# Altium project AnySkin.PrjPcb
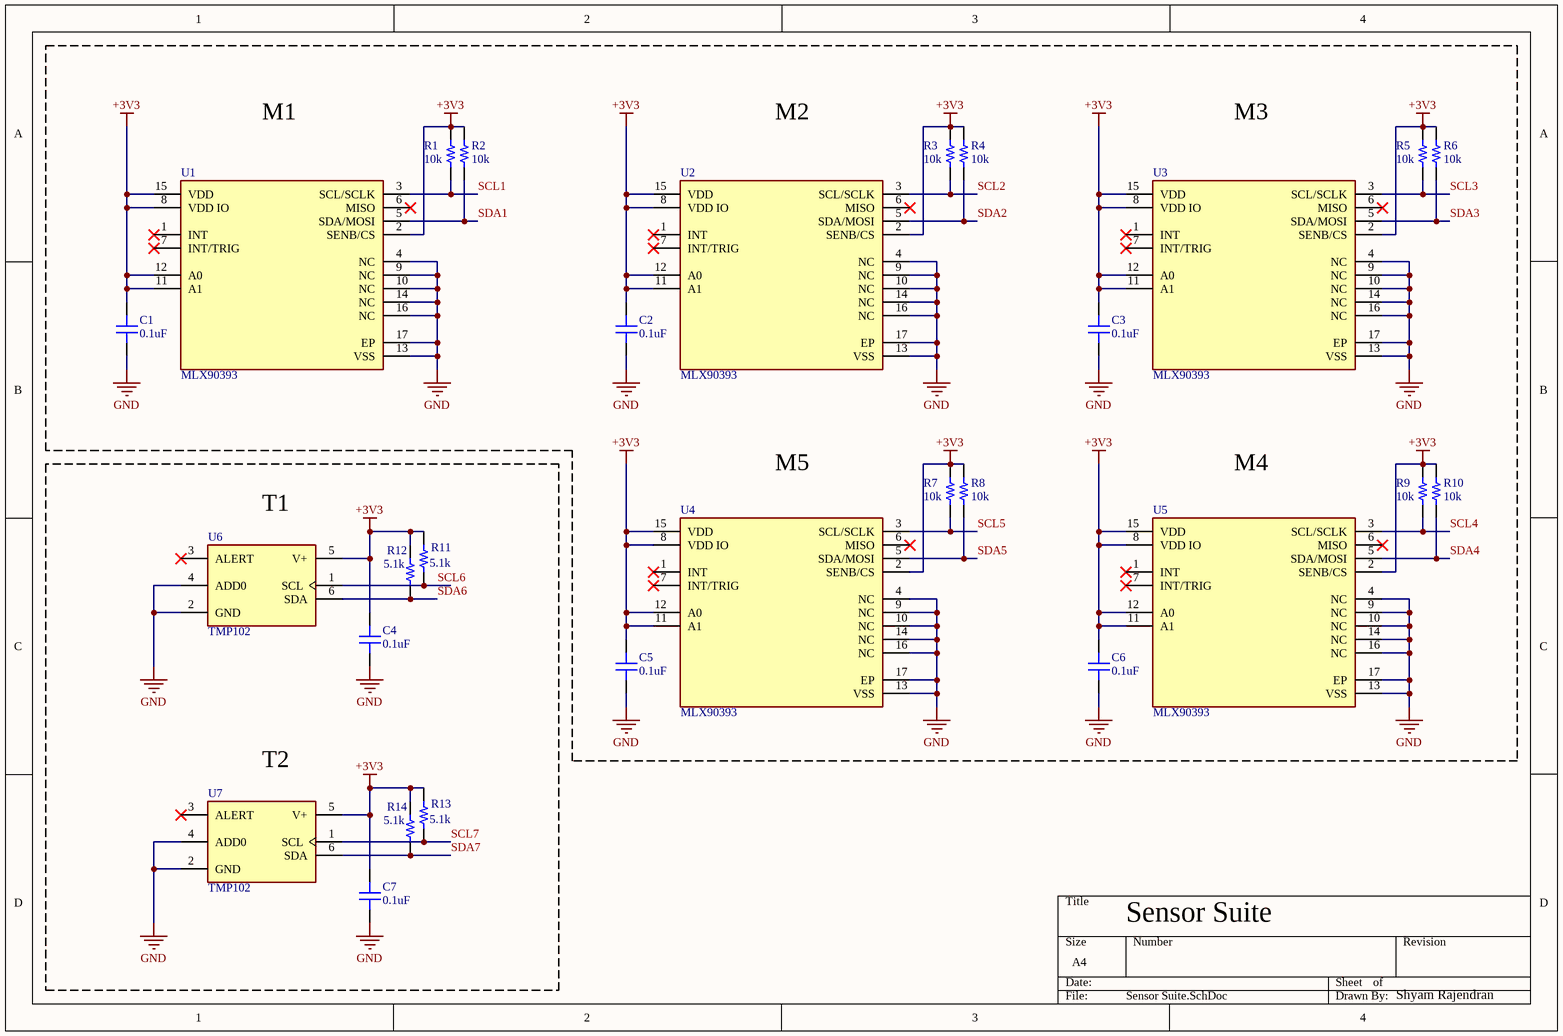
[diagram p0: Sensor Suite.SchDoc]
2 sheets, 41 parts. Net scope: global (net labels, ports and power ports of the same name join across sheets).
Board file: AnySkin.PcbDoc
Sheets:
  Sensor Suite.SchDoc
  Interface.SchDoc

## Sheet Sensor Suite.SchDoc
size A4; SheetNumber: 1; SheetTotal: 2

### Parts
C1  Capacitance: 0.1uF  [CAP 0603_1608]  (hidden comment: 10uF)
C2  Capacitance: 0.1uF  [CAP 0603_1608]  (hidden comment: 10uF)
C3  Capacitance: 0.1uF  [CAP 0603_1608]  (hidden comment: 10uF)
C4  Capacitance: 0.1uF  [CAP 0603_1608]  (hidden comment: 10uF)
C5  Capacitance: 0.1uF  [CAP 0603_1608]  (hidden comment: 10uF)
C6  Capacitance: 0.1uF  [CAP 0603_1608]  (hidden comment: 10uF)
C7  Capacitance: 0.1uF  [CAP 0603_1608]  (hidden comment: 10uF)
R1  10k  [RES 0603_1608]
R2  10k  [RES 0603_1608]
R3  10k  [RES 0603_1608]
R4  10k  [RES 0603_1608]
R5  10k  [RES 0603_1608]
R6  10k  [RES 0603_1608]
R7  10k  [RES 0603_1608]
R8  10k  [RES 0603_1608]
R9  10k  [RES 0603_1608]
R10  10k  [RES 0603_1608]
R11  5.1K  [RES 0603_1608]
R12  5.1K  [RES 0603_1608]
R13  5.1K  [RES 0603_1608]
R14  5.1K  [RES 0603_1608]
U1  MLX90393  [MLX90393]
U2  MLX90393  [MLX90393]
U3  MLX90393  [MLX90393]
U4  MLX90393  [MLX90393]
U5  MLX90393  [MLX90393]
U6  TMP102  [TMP102]
U7  TMP102  [TMP102]

### Nets
+3V3: C1.2 C2.2 C3.2 C4.2 C5.2 C6.2 C7.2 R1.2 R2.2 R3.2 R4.2 R5.2 R6.2 R7.2 R8.2 R9.2 R10.2 R11.1 R12.1 R13.1 R14.1 U1.2(SENB/CS) U1.8(VDD_IO) U1.11(A1) U1.12(A0) U1.15(VDD) U2.2(SENB/CS) U2.8(VDD_IO) U2.11(A1) U2.12(A0) U2.15(VDD) U3.2(SENB/CS) U3.8(VDD_IO) U3.11(A1) U3.12(A0) U3.15(VDD) U4.2(SENB/CS) U4.8(VDD_IO) U4.11(A1) U4.12(A0) U4.15(VDD) U5.2(SENB/CS) U5.8(VDD_IO) U5.11(A1) U5.12(A0) U5.15(VDD) U6.5(V+) U7.5(V+)
GND: C1.1 C2.1 C3.1 C4.1 C5.1 C6.1 C7.1 U1.4(NC) U1.9(NC) U1.10(NC) U1.13(VSS) U1.14(NC) U1.16(NC) U1.17(EP) U2.4(NC) U2.9(NC) U2.10(NC) U2.13(VSS) U2.14(NC) U2.16(NC) U2.17(EP) U3.4(NC) U3.9(NC) U3.10(NC) U3.13(VSS) U3.14(NC) U3.16(NC) U3.17(EP) U4.4(NC) U4.9(NC) U4.10(NC) U4.13(VSS) U4.14(NC) U4.16(NC) U4.17(EP) U5.4(NC) U5.9(NC) U5.10(NC) U5.13(VSS) U5.14(NC) U5.16(NC) U5.17(EP) U6.2(GND) U6.4(ADD0) U7.2(GND) U7.4(ADD0)
SCL1: R1.1 U1.3(SCL/SCLK)
SCL2: R3.1 U2.3(SCL/SCLK)
SCL3: R5.1 U3.3(SCL/SCLK)
SCL4: R9.1 U5.3(SCL/SCLK)
SCL5: R7.1 U4.3(SCL/SCLK)
SCL6: R11.2 U6.1(SCL)
SCL7: R13.2 U7.1(SCL)
SDA1: R2.1 U1.5(SDA/MOSI)
SDA2: R4.1 U2.5(SDA/MOSI)
SDA3: R6.1 U3.5(SDA/MOSI)
SDA4: R10.1 U5.5(SDA/MOSI)
SDA5: R8.1 U4.5(SDA/MOSI)
SDA6: R12.2 U6.6(SDA)
SDA7: R14.2 U7.6(SDA)

Not connected (* = marked no-connect by the designer): U1 1(INT)* 6(MISO)* 7(INT/TRIG)*; U2 1(INT)* 6(MISO)* 7(INT/TRIG)*; U3 1(INT)* 6(MISO)* 7(INT/TRIG)*; U4 1(INT)* 6(MISO)* 7(INT/TRIG)*; U5 1(INT)* 6(MISO)* 7(INT/TRIG)*; U6 3(ALERT)*; U7 3(ALERT)*

### Notes on the sheet
- M1
- M2
- M3
- (near U6) T1
- M5
- M4
- (near U7) T2
- Sensor Suite
- Shyam Rajendran

### Library data of the parts
C1-C7 = GCJ188C70J335KE02D: 0603; manufacturer: Murata Electronics; Temperature Coefficient: X7S; Tolerance: ±10%; value: 3.3 µF; Voltage - Rated: 6.3V; Part Number: GCJ188C70J335KE02D; Applications: Automotive, Boardflex Sensitive; componentlink1description: Datasheet; componentlink1url: https://search.murata.co.jp/Ceramy/image/img/A01X/G101/ENG/GCJ188C70J335KE02-01A.pdf; componentlink2description: DigiKey Link; componentlink2url: https://www.digikey.com/en/products/detail/murata-electronics/GCJ188C70J335KE02D/10696585; Device Package: 0603 (1608 Metric); Features: Soft Termination; lastupdated: 09-02-2024 20:08:53; Lifecycle Status: Active; Minimum Order: 1; Mounting Type: Surface Mount, MLCC; Operating Temperature: -55°C ~ 125°C; Package / Case: 0603 (1608 Metric); packaging: TapeAndReel; partid: 55427; Part Status: Active; price: 0.04; Ratings: AEC-Q200; series: GCJ; Size / Dimension: 0.063" L x 0.031" W (1.60mm x 0.80mm); Supplier 1: DigiKey; Supplier Part Number 1: 490-GCJ188C70J335KE02DCT-ND; Thickness (Max): 0.039" (1.00mm)
R1-R10 = RNCS0603BKE10K0: RES 10K OHM 0.1% 1/16W 0603; Manufacturer: Stackpole Electronics Inc; Power (Watts): 0.063W, 1/16W; Resistance: 10 kOhms; Temperature Coefficient: ±25ppm/°C; Part Number: RNCS0603BKE10K0; Value: 10k; ComponentLink1Description: Datasheet; ComponentLink1URL: https://www.seielect.com/catalog/sei-rncs_rnch.pdf; ComponentLink2Description: DigiKey Link; ComponentLink2URL: https://www.digikey.com/en/products/detail/stackpole-electronics-inc/RNCS0603BKE10K0/1708836; Composition: Thin Film; Device Package: 0603 (1608 Metric); Features: Anti-Corrosive, Automotive AEC-Q200, Moisture Resistant; Height - Seated (Max): 0.022" (0.55mm); LastUpdated: 09-02-2024 20:43:37; Lifecycle Status: Active; Minimum Order: 1; Number of Terminations: 2; Operating Temperature: -55°C ~ 155°C; Package / Case: 0603 (1608 Metric); Packaging: TapeAndReel; PartId: 4838; Part Status: Active; Price: 0.06; Ratings: AEC-Q200; Series: RNCS; Size / Dimension: 0.061" L x 0.031" W (1.55mm x 0.80mm); Supplier 1: DigiKey; Supplier Part Number 1: RNCS0603BKE10K0CT-ND; Supplier Device Package: 0603; Tolerance: ±0.1%
R11-R14 = RNCS0603BKE10K0: 0603; Manufacturer: Stackpole Electronics Inc; Power (Watts): 0.063W, 1/16W; Resistance: 10 kOhms; Temperature Coefficient: ±25ppm/°C; Tolerance: ±0.1%; Part Number: RNCS0603BKE10K0; Value: 5.1k; ComponentLink1Description: Datasheet; ComponentLink1URL: https://www.seielect.com/catalog/sei-rncs_rnch.pdf; ComponentLink2Description: DigiKey Link; ComponentLink2URL: https://www.digikey.com/en/products/detail/stackpole-electronics-inc/RNCS0603BKE10K0/1708836; Composition: Thin Film; Device Package: 0603 (1608 Metric); Features: Anti-Corrosive, Automotive AEC-Q200, Moisture Resistant; Height - Seated (Max): 0.022" (0.55mm); LastUpdated: 09-02-2024 20:43:37; Lifecycle Status: Active; Minimum Order: 1; Number of Terminations: 2; Operating Temperature: -55°C ~ 155°C; Package / Case: 0603 (1608 Metric); Packaging: TapeAndReel; PartId: 4838; Part Status: Active; Price: 0.06; Ratings: AEC-Q200; Series: RNCS; Size / Dimension: 0.061" L x 0.031" W (1.55mm x 0.80mm); Supplier 1: DigiKey; Supplier Part Number 1: RNCS0603BKE10K0CT-ND; Supplier Device Package: 0603
U1-U5 = MLX90393ELW-ABA-011-RE: Analog Circuit, 1 Func; Manufacturer: Melexis; Channels: 1; Max Supply Voltage: 3.6V; Min Supply Voltage: 2.2V; Nominal Supply Voltage: 3V; Supplier: Digikey; Supplier Part Number: MLX90393ELW-ABA-011-RECT-ND; Manufacturer Part Number: MLX90393ELW-ABA-011-RE; RoHS: Yes; Category: Magnetic Sensors; Stock: 37550; Pricing: 1=2.21, 5=1.964, 10=1.872, 25=1.7632, 50=1.689, 100=1.6211, 500=1.48448, 1000=1.43365 (USD); Case/Package: VQCCN; Pins: 16; Package Shape: Square; Terminal Finish: Tin; Min Operating Temperature: -40°C; Max Operating Temperature: 85°C; Throw Configuration: ANALOG CIRCUIT; JESD-30 Code: S-XQCC-N16; Package Style: CHIP CARRIER, VERY THIN PROFILEMeter; Surface Mount: Yes; Terminal Form: No Lead; Terminal Position: QUAD; Length: 3mm; Width: 3mm; Height - Seated (Max): 1mm; Terminal Pitch: 0.5mm; Temperature Grade: INDUSTRIAL; Reach SVHC Compliant: Yes; RoHS Compliant: Yes; ComponentLink1URL: https://datasheet.ciiva.com:443/pdfs/VipMasterIC/IC/MELE/MELE-S-A0009883443/MELE-S-A0009883443-1.pdf?src-supplier=IHS+Markit; ComponentLink1Description: https://datasheet.ciiva.com:443/pdfs/VipMasterIC/IC/MELE/MELE-S-A0009883443/MELE-S-A0009883443-1.pdf?src-supplier=IHS+Markit; ComponentLink2URL: https://www.melexis.com/-/media/files/documents/application-notes/mlx90393-application-note-melexis.pdf?src-supplier=Digikey; ComponentLink2Description: https://www.melexis.com/-/media/files/documents/application-notes/mlx90393-application-note-melexis.pdf?src-supplier=Digikey; ComponentLink3URL: https://www.melexis.com/-/media/files/documents/datasheets/mlx90393-datasheet-melexis.pdf?src-supplier=Digikey; ComponentLink3Description: https://www.melexis.com/-/media/files/documents/datasheets/mlx90393-datasheet-melexis.pdf?src-supplier=Digikey; ComponentLink4URL: https://datasheet.octopart.com/MLX90393ELW-ABA-011-RE-Melexis-datasheet-62983775.pdf?src-supplier=Future+Electronics; ComponentLink4Description: https://datasheet.octopart.com/MLX90393ELW-ABA-011-RE-Melexis-datasheet-62983775.pdf?src-supplier=Future+Electronics
U6 U7 = TMP102: SENSOR DIGITAL -40C-125C SOT563; Number of Bits: 12; Output Current: 3mA; Max Supply Voltage: 3.6V; Min Supply Voltage: 1.4V; Nominal Supply Current: 85uA; Operating Supply Current: 1uA; Resolution: 12b; Interface: I2C; Quiescent Current: 10uA; Lead Free: Lead Free; RoHS Compliant: Yes; Package Quantity: 4000; Weight: 9.9E-05oz; Series: -; Output Type: Digital; Radiation Hardening: No; Max Operating Temperature: 125°C; Case/Package: SOT-563; REACH SVHC: No SVHC; Number of Pins: 6; Supply Current: 85uA; Max Supply Voltage (DC): 3.6V; Min Supply Voltage (DC): 1.4V; Mount: Surface Mount; Min Operating Temperature: -40°C; Packaging: Tape and Reel

## Sheet Interface.SchDoc
size A4; SheetNumber: 2; SheetTotal: 2
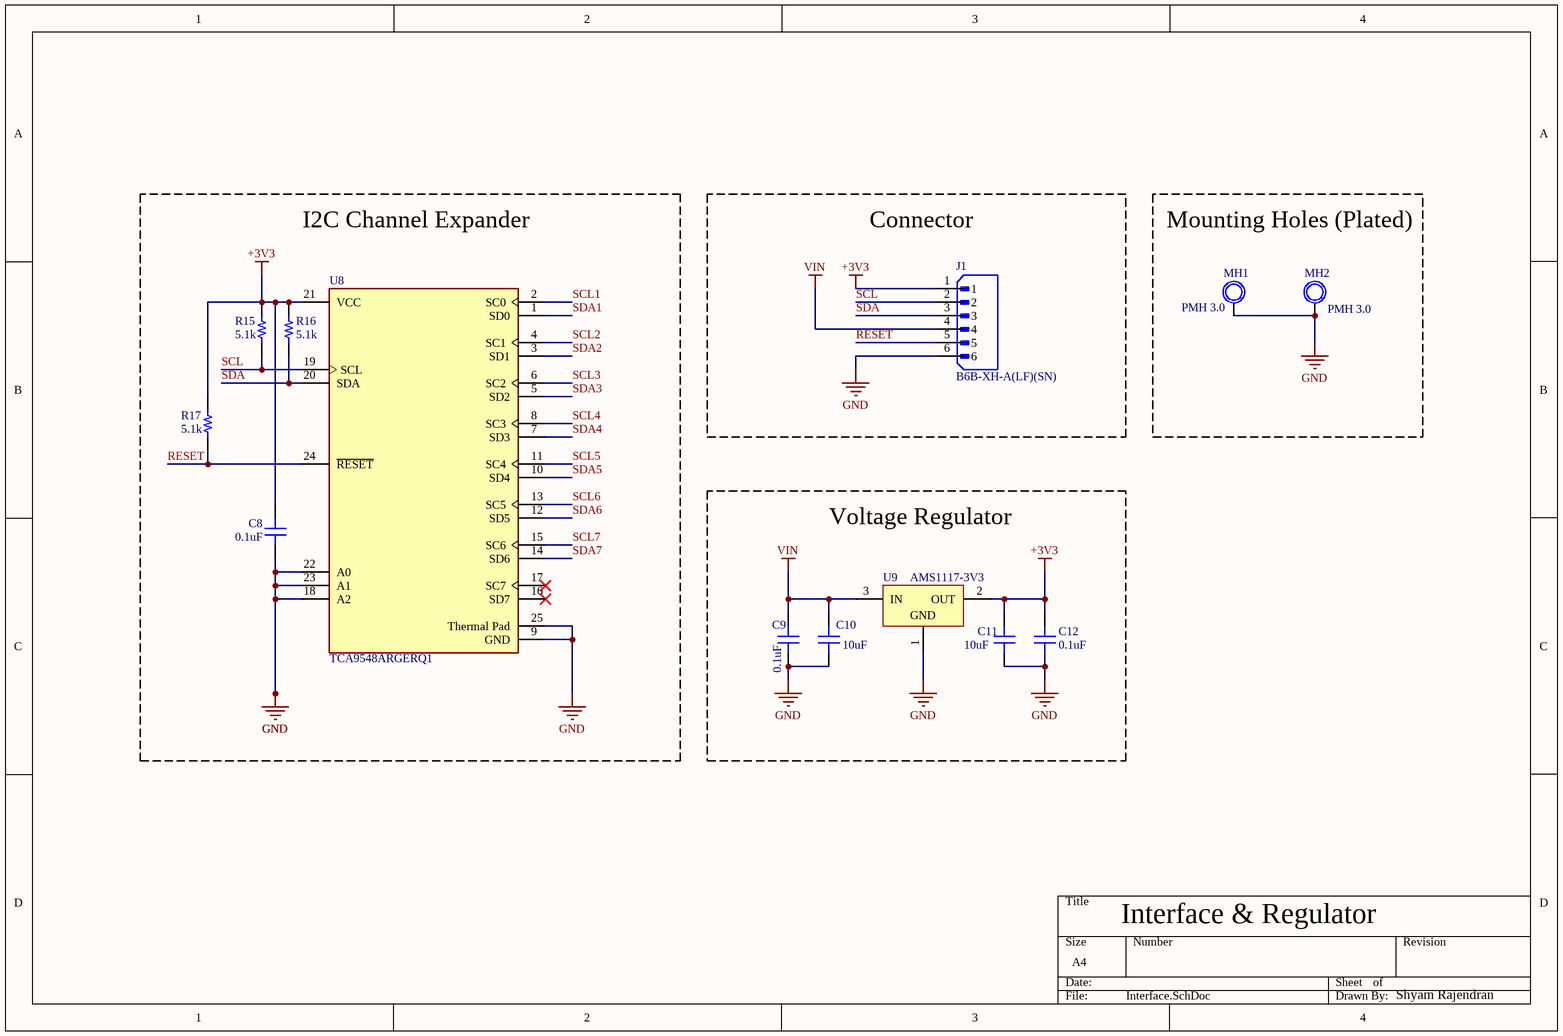
[diagram p1: Interface.SchDoc]

### Parts
C8  Capacitance: 0.1uF  [CAP 0603_1608]  (hidden comment: 10uF)
C9  Capacitance: 0.1uF  [CAP 0603_1608]  (hidden comment: 10uF)
C10  10uF  [CAP 0603_1608]
C11  10uF  [CAP 0603_1608]
C12  Capacitance: 0.1uF  [CAP 0603_1608]  (hidden comment: 10uF)
J1  B6B-XH-A(LF)(SN)  [JST_B6B-XH-A(LF)(SN)]
MH1  PMH 3.0  [NPMH]
MH2  PMH 3.0  [NPMH]
R15  5.1K  [RES 0603_1608]
R16  5.1K  [RES 0603_1608]
R17  5.1K  [RES 0603_1608]
U8  TCA9548ARGERQ1  [TCA9548]
U9  AMS1117-3V3  [AMS1117, 5V]

### Blocks framed on the sheet
I2C Channel Expander: C8 R15-R17 U8
Connector: J1
Mounting Holes (Plated): MH1 MH2
Voltage Regulator: C9-C12 U9

### Nets
+3V3: C8.2 C11.2 C12.2 J1.1 R15.2 R16.2 R17.2 U8.21(VCC) U9.2(OUT)
GND: C8.1 C9.1 C10.1 C11.1 C12.1 J1.6 MH1.GND MH2.GND U8.9(GND) U8.18(A2) U8.22(A0) U8.23(A1) U8.25(Thermal_Pad) U9.1(GND)
VIN: C9.2 C10.2 J1.4 U9.3(IN)
RESET: J1.5 R17.1 U8.24(~{RESET})
SCL: J1.2 R15.1 U8.19(SCL)
SCL1: U8.2(SC0)
SCL2: U8.4(SC1)
SCL3: U8.6(SC2)
SCL4: U8.8(SC3)
SCL5: U8.11(SC4)
SCL6: U8.13(SC5)
SCL7: U8.15(SC6)
SDA: J1.3 R16.1 U8.20(SDA)
SDA1: U8.1(SD0)
SDA2: U8.3(SD1)
SDA3: U8.5(SD2)
SDA4: U8.7(SD3)
SDA5: U8.10(SD4)
SDA6: U8.12(SD5)
SDA7: U8.14(SD6)

Not connected (* = marked no-connect by the designer): U8 16(SD7)* 17(SC7)*

### Notes on the sheet
- Interface & Regulator
- Shyam Rajendran

### Library data of the parts
C8-C12 = GCJ188C70J335KE02D: as C1 on sheet Sensor Suite; Part Number: GCJ188C70J335KE02D; Applications: Automotive, Boardflex Sensitive; componentlink1description: Datasheet; componentlink1url: https://search.murata.co.jp/Ceramy/image/img/A01X/G101/ENG/GCJ188C70J335KE02-01A.pdf; componentlink2description: DigiKey Link; componentlink2url: https://www.digikey.com/en/products/detail/murata-electronics/GCJ188C70J335KE02D/10696585; Device Package: 0603 (1608 Metric); Features: Soft Termination; lastupdated: 09-02-2024 20:08:53; Lifecycle Status: Active; Minimum Order: 1; Mounting Type: Surface Mount, MLCC; Operating Temperature: -55°C ~ 125°C; Package / Case: 0603 (1608 Metric); packaging: TapeAndReel; partid: 55427; Part Status: Active; price: 0.04; Ratings: AEC-Q200; series: GCJ; Size / Dimension: 0.063" L x 0.031" W (1.60mm x 0.80mm); Supplier 1: DigiKey; Supplier Part Number 1: 490-GCJ188C70J335KE02DCT-ND; Thickness (Max): 0.039" (1.00mm)
  C10 C11: Capacitance: 10uF
J1 = B6B-XH-A(LF)(SN): Connector Header Through Hole 6 position 0.098 (2.50mm); MF: JST Sales; SnapEDA_Link: https://www.snapeda.com/parts/B6B-XH-A(LF)(SN)/JST+Sales+America+Inc./view-part/?ref=snap; Package: None; Value: *; MP: B6B-XH-A(LF)(SN); Check_prices: https://www.snapeda.com/parts/B6B-XH-A(LF)(SN)/JST+Sales+America+Inc./view-part/?ref=eda
MH1 MH2 = PMH: PMH 3.0mm
R15-R17 = RNCS0603BKE10K0: as R11 on sheet Sensor Suite; Part Number: RNCS0603BKE10K0; Value: 5.1k; ComponentLink1Description: Datasheet; ComponentLink1URL: https://www.seielect.com/catalog/sei-rncs_rnch.pdf; ComponentLink2Description: DigiKey Link; ComponentLink2URL: https://www.digikey.com/en/products/detail/stackpole-electronics-inc/RNCS0603BKE10K0/1708836; Composition: Thin Film; Device Package: 0603 (1608 Metric); Features: Anti-Corrosive, Automotive AEC-Q200, Moisture Resistant; Height - Seated (Max): 0.022" (0.55mm); LastUpdated: 09-02-2024 20:43:37; Lifecycle Status: Active; Minimum Order: 1; Number of Terminations: 2; Operating Temperature: -55°C ~ 155°C; Package / Case: 0603 (1608 Metric); Packaging: TapeAndReel; PartId: 4838; Part Status: Active; Price: 0.06; Ratings: AEC-Q200; Series: RNCS; Size / Dimension: 0.061" L x 0.031" W (1.55mm x 0.80mm); Supplier 1: DigiKey; Supplier Part Number 1: RNCS0603BKE10K0CT-ND; Supplier Device Package: 0603
U8 = TCA9548ARGERQ1: I2C Switch with Reset 8 Channel Bi-Directional 1.65V to 5.25V 24-Pin VQFN Cut Tape; ComponentLink3Description: https://datasheet.ciiva.com:443/pdfs/VipMasterIC/IC/WBND/WBND-S-A0002933800/WBND-S-A0002933800-1.pdf?src-supplier=IHS+Markit; Min Supply Voltage: 1.65V; Max Supply Voltage: 5.25V; RoHS: Compliant; Length: 4mm; ComponentLink2Description: http://www.winbond.com/resource-files/w25q128jv%20spi%20revc%2011162016.pdf?src-supplier=Digikey; Width: 4mm; Min Operating Temperature: -40°C; ComponentLink1Description: http://www.winbond.com/resource-files/w25q128jv%20revf%2003272018%20plus.pdf?src-supplier=Digikey; Pins: 24; Case/Package: VQFN; Max Operating Temperature: 85°C
U9 = AMS1117-3V3: SOT89

## Nets that join several sheets
+3V3: Sensor Suite (48 pins), Interface (9 pins)
GND: Sensor Suite (46 pins), Interface (14 pins)
SCL1: Sensor Suite (R1.1 U1.3), Interface (U8.2)
SCL2: Sensor Suite (R3.1 U2.3), Interface (U8.4)
SCL3: Sensor Suite (R5.1 U3.3), Interface (U8.6)
SCL4: Sensor Suite (R9.1 U5.3), Interface (U8.8)
SCL5: Sensor Suite (R7.1 U4.3), Interface (U8.11)
SCL6: Sensor Suite (R11.2 U6.1), Interface (U8.13)
SCL7: Sensor Suite (R13.2 U7.1), Interface (U8.15)
SDA1: Sensor Suite (R2.1 U1.5), Interface (U8.1)
SDA2: Sensor Suite (R4.1 U2.5), Interface (U8.3)
SDA3: Sensor Suite (R6.1 U3.5), Interface (U8.5)
SDA4: Sensor Suite (R10.1 U5.5), Interface (U8.7)
SDA5: Sensor Suite (R8.1 U4.5), Interface (U8.10)
SDA6: Sensor Suite (R12.2 U6.6), Interface (U8.12)
SDA7: Sensor Suite (R14.2 U7.6), Interface (U8.14)